# EAGLE design main-01 (EAGLE 7.6.0)
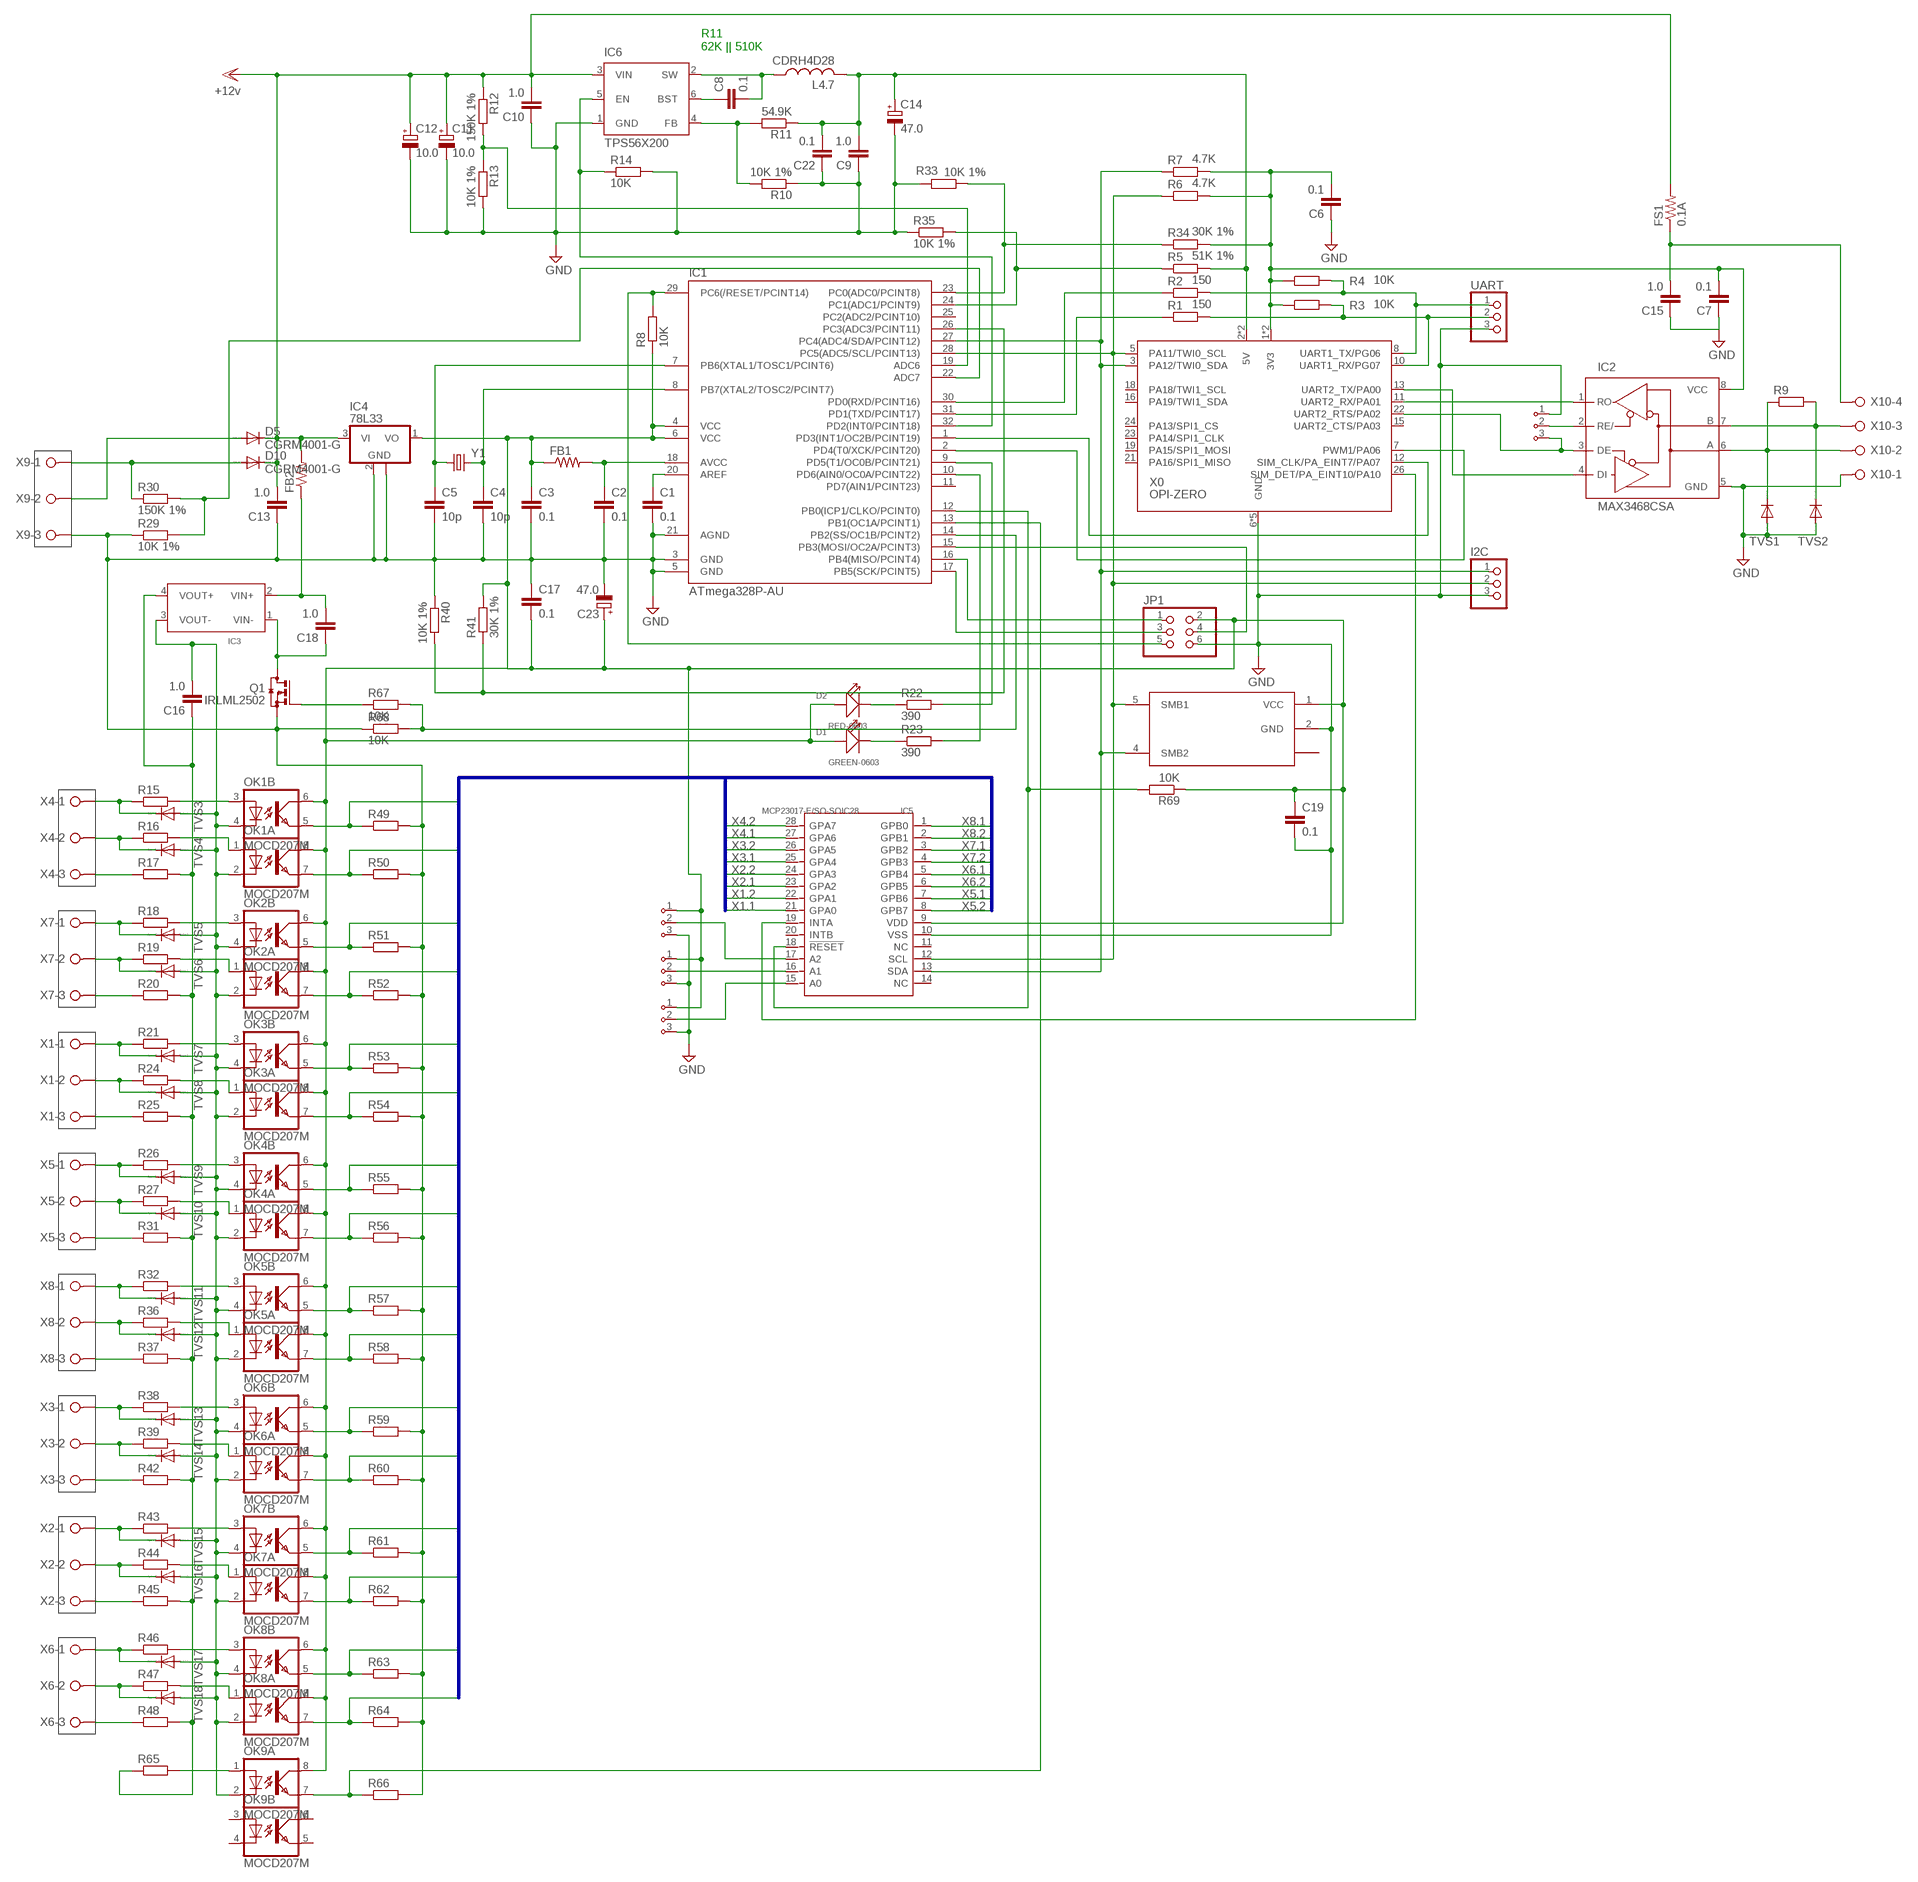
[diagram p0: schematic, sheet 1]

## Parts
4  ADDR3PIN0603  [0603-3PIN]
A0  ADDR3PIN0603  [0603-3PIN]
A1  ADDR3PIN0603  [0603-3PIN]
A2  ADDR3PIN0603  [0603-3PIN]
C1  0.1  C-EUC0603  [C0603]
C2  0.1  C-EUC0603  [C0603]
C3  0.1  C-EUC0603  [C0603]
C4  10p  C-EUC0603  [C0603]
C5  10p  C-EUC0603  [C0603]
C6  0.1  C-EUC0805  [C0805]
C7  0.1  C-EUC0805  [C0805]
C8  0.1  C-EUC0805  [C0805]
C9  1.0  C-EUC0805  [C0805]
C10  1.0  C-EUC1206  [C1206]
C11  10.0  CPOL-EUC/6032-28R  [C/6032-28R]
C12  10.0  CPOL-EUC/6032-28R  [C/6032-28R]
C13  1.0  C-EUC1206  [C1206]
C14  47.0  CPOL-EUB/3528-21R  [B/3528-21R]
C15  1.0  C-EUC1206  [C1206]
C16  1.0  C-EUC1206  [C1206]
C17  0.1  C-EUC0603  [C0603]
C18  1.0  C-EUC1206  [C1206]
C19  0.1  C-EUC0603  [C0603]
C22  0.1  C-EUC0805  [C0805]
C23  47.0  CPOL-EUB/3528-21R  [B/3528-21R]
D1  GREEN-0603  SMD-LED-CLEAR-GREEN(0603)  [LED-0603]
D2  RED-0603  SMD-LED-CLEAR-BLUE(0603)  [LED-0603]
D5  CGRM4001-G  [SOD-123_MINI-SMA]
D10  CGRM4001-G  [SOD-123_MINI-SMA]
FB1  R-US_R0805  [R0805]
FB2  R-US_R1206  [R1206]
FS1  0.1A  R-US_R1210  [R1210]
I2C  PINHD-1X3  [1X03]
IC1  ATmega328P-AU  MEGA48/88/168-AU  [TQFP32-08]
IC2  MAX3468CSA  [SO08]
IC3  DC-DC-CONV-4PIN-ISOLATINGMURATA-NME-05-12-SERIES  [DC-DC-MURATA-NME-05-12-SERIES]
IC4  78L33  78L05F  [SOT89]
IC5  MCP23017-E/SO-SOIC28  INTERFACE-MCP23017-E(SOIC28)  [SOIC28-1.27-17.9X7.5MM]
IC6  TPS56X200  [TSOT23-6_DDC]
IC7  LTC1694  [SOT23-5]
JP1  PINHD-2X3  [2X03]
L4.7  CDRH4D28  [CDRH4D28]
OK1  MOCD207M  [SOIC08-FAIRCHILD]
OK2  MOCD207M  [SOIC08-FAIRCHILD]
OK3  MOCD207M  [SOIC08-FAIRCHILD]
OK4  MOCD207M  [SOIC08-FAIRCHILD]
OK5  MOCD207M  [SOIC08-FAIRCHILD]
OK6  MOCD207M  [SOIC08-FAIRCHILD]
OK7  MOCD207M  [SOIC08-FAIRCHILD]
OK8  MOCD207M  [SOIC08-FAIRCHILD]
OK9  MOCD207M  [SOIC08-FAIRCHILD]
Q1  IRLML2502  [SOT23]
R1  150  R-EU_R0603  [R0603]
R2  150  R-EU_R0603  [R0603]
R3  10K  R-EU_R0603  [R0603]
R4  10K  R-EU_R0603  [R0603]
R5  51K 1%  R-EU_R0603  [R0603]
R6  4.7K  R-EU_R0603  [R0603]
R7  4.7K  R-EU_R0603  [R0603]
R8  10K  R-EU_R0603  [R0603]
R9  R-EU_R1206  [R1206]
R10  10K 1%  R-EU_R0603  [R0603]
R11  54.9K  R-EU_R0603  [R0603]
R12  150K 1%  R-EU_R0603  [R0603]
R13  10K 1%  R-EU_R0603  [R0603]
R14  10K  R-EU_R0603  [R0603]
R15  R-EU_R0603  [R0603]
R16  R-EU_R0603  [R0603]
R17  R-EU_R0603  [R0603]
R18  R-EU_R0603  [R0603]
R19  R-EU_R0603  [R0603]
R20  R-EU_R0603  [R0603]
R21  R-EU_R0603  [R0603]
R22  390  R-EU_R0603  [R0603]
R23  390  R-EU_R0603  [R0603]
R24  R-EU_R0603  [R0603]
R25  R-EU_R0603  [R0603]
R26  R-EU_R0603  [R0603]
R27  R-EU_R0603  [R0603]
R29  10K 1%  R-EU_R0603  [R0603]
R30  150K 1%  R-EU_R0603  [R0603]
R31  R-EU_R0603  [R0603]
R32  R-EU_R0603  [R0603]
R33  10K 1%  R-EU_R0603  [R0603]
R34  30K 1%  R-EU_R0603  [R0603]
R35  10K 1%  R-EU_R0603  [R0603]
R36  R-EU_R0603  [R0603]
R37  R-EU_R0603  [R0603]
R38  R-EU_R0603  [R0603]
R39  R-EU_R0603  [R0603]
R40  10K 1%  R-EU_R0603  [R0603]
R41  30K 1%  R-EU_R0603  [R0603]
R42  R-EU_R0603  [R0603]
R43  R-EU_R0603  [R0603]
R44  R-EU_R0603  [R0603]
R45  R-EU_R0603  [R0603]
R46  R-EU_R0603  [R0603]
R47  R-EU_R0603  [R0603]
R48  R-EU_R0603  [R0603]
R49  R-EU_R0603  [R0603]
R50  R-EU_R0603  [R0603]
R51  R-EU_R0603  [R0603]
R52  R-EU_R0603  [R0603]
R53  R-EU_R0603  [R0603]
R54  R-EU_R0603  [R0603]
R55  R-EU_R0603  [R0603]
R56  R-EU_R0603  [R0603]
R57  R-EU_R0603  [R0603]
R58  R-EU_R0603  [R0603]
R59  R-EU_R0603  [R0603]
R60  R-EU_R0603  [R0603]
R61  R-EU_R0603  [R0603]
R62  R-EU_R0603  [R0603]
R63  R-EU_R0603  [R0603]
R64  R-EU_R0603  [R0603]
R65  R-EU_R0603  [R0603]
R66  R-EU_R0603  [R0603]
R67  10K  R-EU_R0603  [R0603]
R68  10K  R-EU_R0603  [R0603]
R69  10K  R-EU_R0603  [R0603]
TVS1  DIODE-SOD323-W  [SOD323-W]
TVS2  DIODE-SOD323-W  [SOD323-W]
TVS3  DIODE-SOD323-W  [SOD323-W]
TVS4  DIODE-SOD323-W  [SOD323-W]
TVS5  DIODE-SOD323-W  [SOD323-W]
TVS6  DIODE-SOD323-W  [SOD323-W]
TVS7  DIODE-SOD323-W  [SOD323-W]
TVS8  DIODE-SOD323-W  [SOD323-W]
TVS9  DIODE-SOD323-W  [SOD323-W]
TVS10  DIODE-SOD323-W  [SOD323-W]
TVS11  DIODE-SOD323-W  [SOD323-W]
TVS12  DIODE-SOD323-W  [SOD323-W]
TVS13  DIODE-SOD323-W  [SOD323-W]
TVS14  DIODE-SOD323-W  [SOD323-W]
TVS15  DIODE-SOD323-W  [SOD323-W]
TVS16  DIODE-SOD323-W  [SOD323-W]
TVS17  DIODE-SOD323-W  [SOD323-W]
TVS18  DIODE-SOD323-W  [SOD323-W]
UART  PINHD-1X3  [1X03]
X0  OPI-ZERO  [OPI0]
X1  W237-03P  [W237-133]
X2  W237-03P  [W237-133]
X3  W237-03P  [W237-133]
X4  W237-03P  [W237-133]
X5  W237-03P  [W237-133]
X6  W237-03P  [W237-133]
X7  W237-03P  [W237-133]
X8  W237-03P  [W237-133]
X9  W237-03P  [W237-133]
X10  W237-04P  [W237-4P]
Y1  CRYSTALHC49US  [HC49US]

## Nets
12V [POWER]: C10.2 C11.+ C12.+ C13.2 D5.C D10.C FB2.2 FS1.2 IC4.3(VI) IC6.3(VIN) R12.1 ; supply symbol labelled +12v
GND [POWER]: 4.1 A0.3 A1.3 A2.3 C1.2 C2.2 C3.2 C4.2 C5.2 C6.1 C7.1 C9.1 C10.1 C11.- C12.- C13.1 C14.- C15.1 C17.1 C19.2 C22.1 C23.- I2C.3 IC1.3(GND) IC1.5(GND) IC1.21(AGND) IC2.5(GND) IC4.2(GND) IC4.2@1(GND) IC5.10(VSS) IC6.1(GND) IC7.2(GND) JP1.6 Q1.2(S) R10.1 R13.2 R14.2 R29.1 R33.2 R35.1 R40.1 R49.2 R50.2 R51.2 R52.2 R53.2 R54.2 R55.2 R56.2 R57.2 R58.2 R59.2 R60.2 R61.2 R62.2 R63.2 R64.2 R66.2 R68.1 TVS1.A TVS2.A UART.3 X0.6(GND) X0.9(GND) X0.14(GND) X0.20(GND) X0.25(GND) X9.3 X10.1
N$1: 4.3 IC2.3(DE) X0.22(UART2_RTS/PA02)
N$2: IC2.1(RO) X0.11(UART2_RX/PA01)
N$3 [POWER]: C8.2 IC6.2(SW) L4.7.P$1
N$4: C4.1 IC1.8(PB7(XTAL2/TOSC2/PCINT7)) Y1.2
N$5: IC1.30(PD0(RXD/PCINT16)) R2.1
N$6: IC1.31(PD1(TXD/PCINT17)) R1.1
N$7: R1.2 R3.2 UART.2 X0.10(UART1_RX/PG07)
N$8: R2.2 R4.2 UART.1 X0.8(UART1_TX/PG06)
N$9: IC2.4(DI) X0.13(UART2_TX/PA00)
N$10: C5.1 IC1.7(PB6(XTAL1/TOSC1/PCINT6)) Y1.1
N$11: IC1.24(PC1(ADC1/PCINT9)) R5.1 R35.2
N$12 [POWER]: D5.A X9.2
N$13: IC1.29(PC6(/RESET/PCINT14)) JP1.5 R8.2
N$14: OK1.3(B:A) R15.2
N$15: C1.1 IC1.20(AREF)
N$16: C2.1 FB1.2 IC1.18(AVCC)
N$17: C8.1 IC6.6(BST)
N$18: IC1.15(PB3(MOSI/OC2A/PCINT3)) JP1.4
N$19: IC1.17(PB5(SCK/PCINT5)) JP1.3
N$20: IC1.16(PB4(MISO/PCINT4)) JP1.1
N$21: IC2.6(A) R9.1 TVS1.C X10.2
N$22: IC6.4(FB) R10.2 R11.2
N$23: IC2.7(B) R9.2 TVS2.C X10.3
N$24: C15.2 FS1.1 X10.4
N$25: IC1.19(ADC6) R12.2 R13.1
N$26: R15.1 TVS3.C X4.1
N$27: IC1.32(PD2(INT0/PCINT18)) IC6.5(EN) R14.1
N$28: R16.1 TVS4.C X4.2
N$29: IC1.1(PD3(INT1/OC2B/PCINT19)) X0.12(SIM_CLK/PA_EINT7/PA07)
N$30: R17.1 X4.3
N$31 [POWER]: D10.A R30.1 X9.1
N$32: R18.1 TVS5.C X7.1
N$33: R19.1 TVS6.C X7.2
N$34: R20.1 X7.3
N$35: OK2.3(B:A) R18.2
N$36: R21.1 TVS7.C X1.1
N$37: IC1.10(PD6(AIN0/OC0A/PCINT22)) R23.2
N$38: IC1.9(PD5(T1/OC0B/PCINT21)) R22.2
N$39: OK3.3(B:A) R21.2
N$40: R24.1 TVS8.C X1.2
N$41: R25.1 X1.3
N$42: R26.1 TVS9.C X5.1
N$43: R27.1 TVS10.C X5.2
N$44: R31.1 X5.3
N$45: R32.1 TVS11.C X8.1
N$46: R36.1 TVS12.C X8.2
N$47: R37.1 X8.3
N$48: R38.1 TVS13.C X3.1
N$49: R39.1 TVS14.C X3.2
N$50: R42.1 X3.3
N$51: R43.1 TVS15.C X2.1
N$52: R44.1 TVS16.C X2.2
N$53: R45.1 X2.3
N$54: R46.1 TVS17.C X6.1
N$55: R47.1 TVS18.C X6.2
N$56: R48.1 X6.3
N$57: OK4.3(B:A) R26.2
N$58: OK5.3(B:A) R32.2
N$59: OK6.3(B:A) R38.2
N$60: OK7.3(B:A) R43.2
N$61: IC1.22(ADC7) R29.2 R30.2
N$62: OK8.3(B:A) R46.2
N$63: C16.1 IC3.4(VOUT+) R17.2 R20.2 R25.2 R31.2 R37.2 R42.2 R45.2 R48.2 R65.1
N$64: IC1.23(PC0(ADC0/PCINT8)) R33.1 R34.1
N$65: OK1.1(A:A) R16.2
N$66: OK2.1(A:A) R19.2
N$67: OK3.1(A:A) R24.2
N$68: IC1.26(PC3(ADC3/PCINT11)) R40.2 R41.1
N$69: OK4.1(A:A) R27.2
N$70: OK5.1(A:A) R36.2
N$71: OK6.1(A:A) R39.2
N$72: OK7.1(A:A) R44.2
N$73: OK8.1(A:A) R47.2
N$74: C16.2 IC3.3(VOUT-) OK1.2(A:C) OK1.4(B:C) OK2.2(A:C) OK2.4(B:C) OK3.2(A:C) OK3.4(B:C) OK4.2(A:C) OK4.4(B:C) OK5.2(A:C) OK5.4(B:C) OK6.2(A:C) OK6.4(B:C) OK7.2(A:C) OK7.4(B:C) OK8.2(A:C) OK8.4(B:C) OK9.2(A:C) TVS3.A TVS4.A TVS5.A TVS6.A TVS7.A TVS8.A TVS9.A TVS10.A TVS11.A TVS12.A TVS13.A TVS14.A TVS15.A TVS16.A TVS17.A TVS18.A
N$75: D2.- R22.1
N$76: 4.2 IC2.2(RE/)
N$77: IC1.2(PD4(T0/XCK/PCINT20)) X0.7(PWM1/PA06)
N$92: IC5.19(INTA) X0.26(SIM_DET/PA_EINT10/PA10)
N$93: OK9.1(A:A) R65.2
N$94: IC1.13(PB1(OC1A/PCINT1)) OK9.7(A:EMIT) R66.1
N$95: Q1.1(G) R67.1
N$96: IC1.14(PB2(SS/OC1B/PCINT2)) R67.2 R68.2
N$98: C18.1 IC3.1(VIN-) Q1.3(D)
N$99 [POWER]: C18.2 FB2.1 IC3.2(VIN+)
N$115: IC1.12(PB0(ICP1/CLKO/PCINT0)) IC5.18(!RESET) R69.2
N$116: A0.2 IC5.15(A0)
N$117: A1.2 IC5.16(A1)
N$118: A2.2 IC5.17(A2)
N$119: D1.- R23.1
SCL: I2C.2 IC1.28(PC5(ADC5/SCL/PCINT13)) IC5.12(SCL) IC7.5(SMB1) R6.1 X0.5(PA11/TWI0_SCL)
SDA: I2C.1 IC1.27(PC4(ADC4/SDA/PCINT12)) IC5.13(SDA) IC7.4(SMB2) R7.1 X0.3(PA12/TWI0_SDA)
VCC [POWER]: A0.1 A1.1 A2.1 C3.1 C17.2 C19.1 C23.+ D1.+ D2.+ FB1.1 IC1.4(VCC) IC1.6(VCC) IC4.1(VO) IC5.9(VDD) IC7.1(VCC) JP1.2 OK1.6(B:COL) OK1.8(A:COL) OK2.6(B:COL) OK2.8(A:COL) OK3.6(B:COL) OK3.8(A:COL) OK4.6(B:COL) OK4.8(A:COL) OK5.6(B:COL) OK5.8(A:COL) OK6.6(B:COL) OK6.8(A:COL) OK7.6(B:COL) OK7.8(A:COL) OK8.6(B:COL) OK8.8(A:COL) OK9.8(A:COL) R8.1 R41.2 R69.1
X1.1: IC5.21(GPA0) OK3.5(B:EMIT) R53.1
X1.2: IC5.22(GPA1) OK3.7(A:EMIT) R54.1
X2.1: IC5.23(GPA2) OK7.5(B:EMIT) R61.1
X2.2: IC5.24(GPA3) OK7.7(A:EMIT) R62.1
X3.1: IC5.25(GPA4) OK6.5(B:EMIT) R59.1
X3.2: IC5.26(GPA5) OK6.7(A:EMIT) R60.1
X4.1: IC5.27(GPA6) OK1.5(B:EMIT) R49.1
X4.2: IC5.28(GPA7) OK1.7(A:EMIT) R50.1
X5.1: IC5.7(GPB6) OK4.5(B:EMIT) R55.1
X5.2: IC5.8(GPB7) OK4.7(A:EMIT) R56.1
X6.1: IC5.5(GPB4) OK8.5(B:EMIT) R63.1
X6.2: IC5.6(GPB5) OK8.7(A:EMIT) R64.1
X7.1: IC5.3(GPB2) OK2.5(B:EMIT) R51.1
X7.2: IC5.4(GPB3) OK2.7(A:EMIT) R52.1
X8.1: IC5.1(GPB0) OK5.5(B:EMIT) R57.1
X8.2: IC5.2(GPB1) OK5.7(A:EMIT) R58.1
Z3V3 [POWER]: C6.2 C7.2 IC2.8(VCC) R3.1 R4.1 R6.2 R7.2 R34.2 X0.1(3V3) X0.17(3V3)
Z5V [POWER]: C9.2 C14.+ C22.2 L4.7.P$2 R5.2 R11.1 X0.2(5V) X0.4(5V)
Unconnected: IC1.11(PD7(AIN1/PCINT23)) IC1.25(PC2(ADC2/PCINT10)) IC5.11(NC) IC5.14(NC) IC5.20(INTB) IC7.3(NC) OK9.3(B:A) OK9.4(B:C) OK9.5(B:EMIT) OK9.6(B:COL) X0.15(UART2_CTS/PA03) X0.16(PA19/TWI1_SDA) X0.18(PA18/TWI1_SCL) X0.19(PA15/SPI1_MOSI) X0.21(PA16/SPI1_MISO) X0.23(PA14/SPI1_CLK) X0.24(PA13/SPI1_CS)

## Buses
B$1

## Notes on the sheet
- R11
  62K || 510K

## Library data of the parts
4 A0 A1 A2 = components:ADDR3PIN
C1-C10 C13 C15-C19 C22 = rcl:C-EU: CAPACITOR, European symbol
C11 C12 C14 C23 = rcl:CPOL-EU: POLARIZED CAPACITOR, European symbol
D1 = Seeed-OPL-Diode:SMD-LED-CLEAR-GREEN(0603): 304090043; MPN: 19-217-G7C-AN1P2-3T
D2 = Seeed-OPL-Diode:SMD-LED-CLEAR-BLUE(0603): 304090045; MPN: 19-217-BHC-ZL1M2RY-3T; VALUE: BLUE-0603
D5 D10 = diode:CGRM400*-G: Molded plasitc,JEDEC SOD-123/Mini SMA Source: Comchip CGRM4001-G.pdf
FB1 FB2 FS1 = rcl:R-US_: RESISTOR, American symbol
I2C UART = pinhead:PINHD-1X3: PIN HEADER
IC1 = avr-7:MEGA48/88/168
IC2 = maxim:MAX34*: +5V, Fail-Safe, 40Mbps, Profibus RS-485/RS-422 Transceivers Source: MAX3465-MAX3469.pdf; MPN: MAX3468CSA+; OC_FARNELL: unknown; OC_NEWARK: 76K6721
IC3 = SteveMarple:DC-DC-CONV-4PIN-ISOLATING
IC4 = linear:78L*: POSITOIV-VOLTAGE REGULATORS Output up to 100 mA Source: Datasheet <http://focus.ti.com/lit/ds/symlink/ua78l05.pdf>
IC5 = Seeed-OPL-ic:INTERFACE-MCP23017-E(SOIC28): 310070050; MPN: MCP23017-E/SO
IC6 = custom:TPS56X200
IC7 = components:LTC1694: Dual SMBus active pull-up
JP1 = pinhead:PINHD-2X3: PIN HEADER
L4.7 = custom:CDRH4D28
OK1-OK9 = optocoupler:MOCD20*M: MOCD207M, MOCD208M Dual Channel Phototransistor Small Outline Surface Mount Optocouplers Source: Data sheet <http://www.fairchildsemi.com/ds/MO%2FMOCD207-M.pdf>; MF: FAIRCHILD SEMICONDUCTOR; MPN: MOCD207-M; OC_FARNELL: 1623297; OC_NEWARK: 67K0803
Q1 = components:IRLML2502: N-CHANNEL MOS FET
R1-R27 R29-R69 = rcl:R-EU_: RESISTOR, European symbol
TVS1-TVS18 = diode:DIODE-: DIODE
X0 = OrangePi0:OPI-ZERO: Orange Pi Zero Footprint. Only 2x13 pin header. -- UNTESTED!
X1-X9 = con-wago-508:W237-03P: WAGO SREW CLAMP; OC_FARNELL: unknown; OC_NEWARK: unknown
X10 = con-wago-508:W237-04P: WAGO SREW CLAMP; OC_FARNELL: unknown; OC_NEWARK: unknown
Y1 = SteveMarple:CRYSTAL: Crystals Various standard crystals. Proven footprints. Spark Fun Electronics SKU : COM-00534

## Net classes
0 default: width 0.254 mm, clearance 0.254 mm
1 POWER: width 0.508 mm, clearance 0.254 mm
2 HV: width 1.27 mm, clearance 1.27 mm

## Board
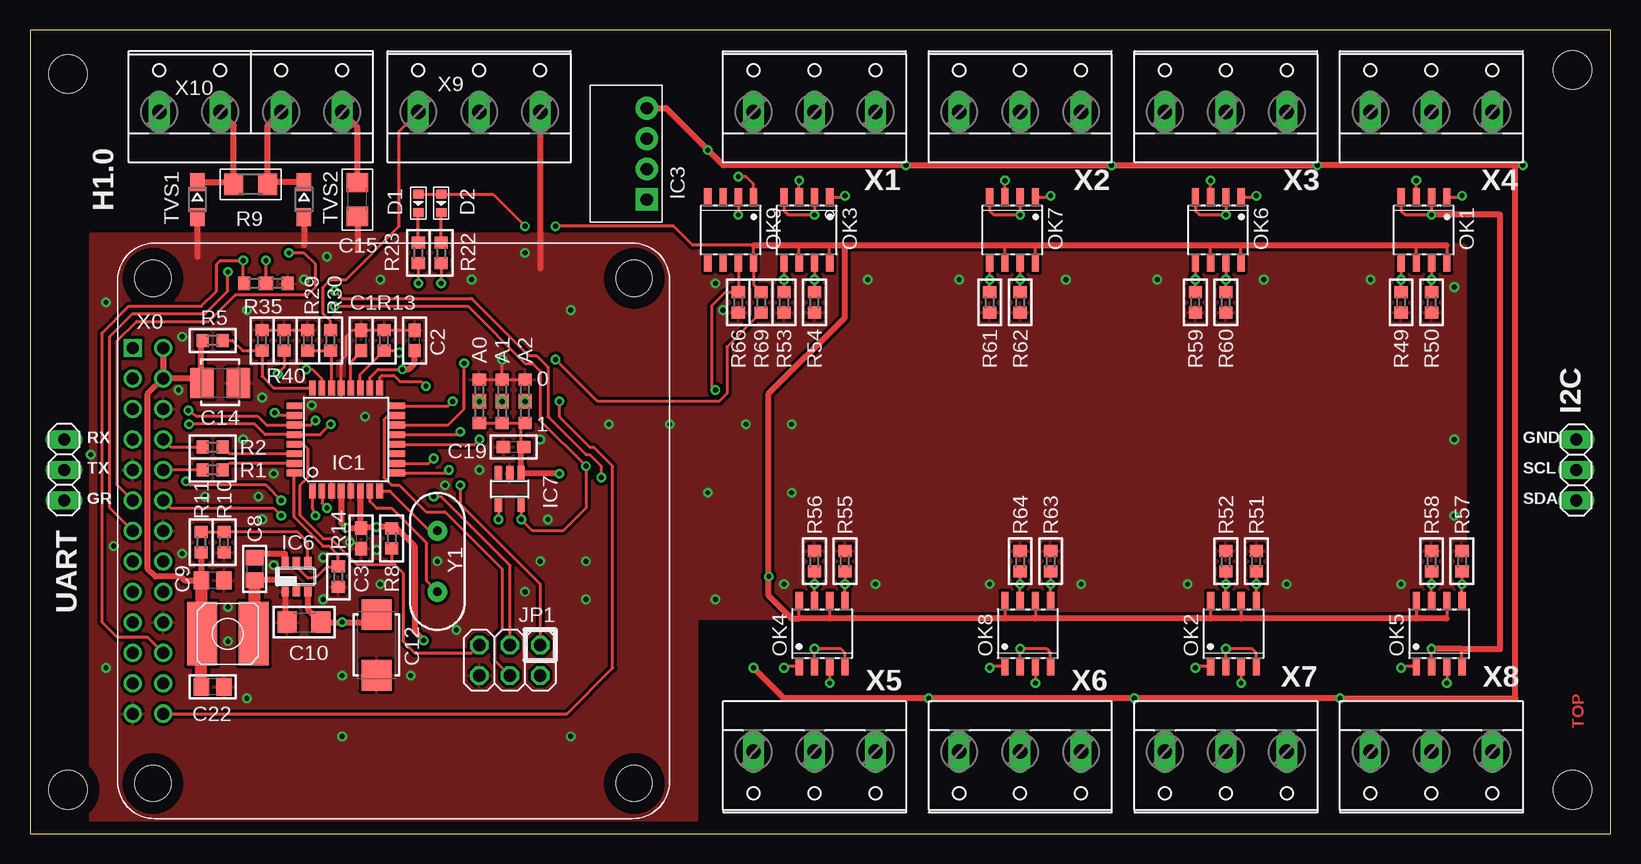
[diagram p1: board, top side]
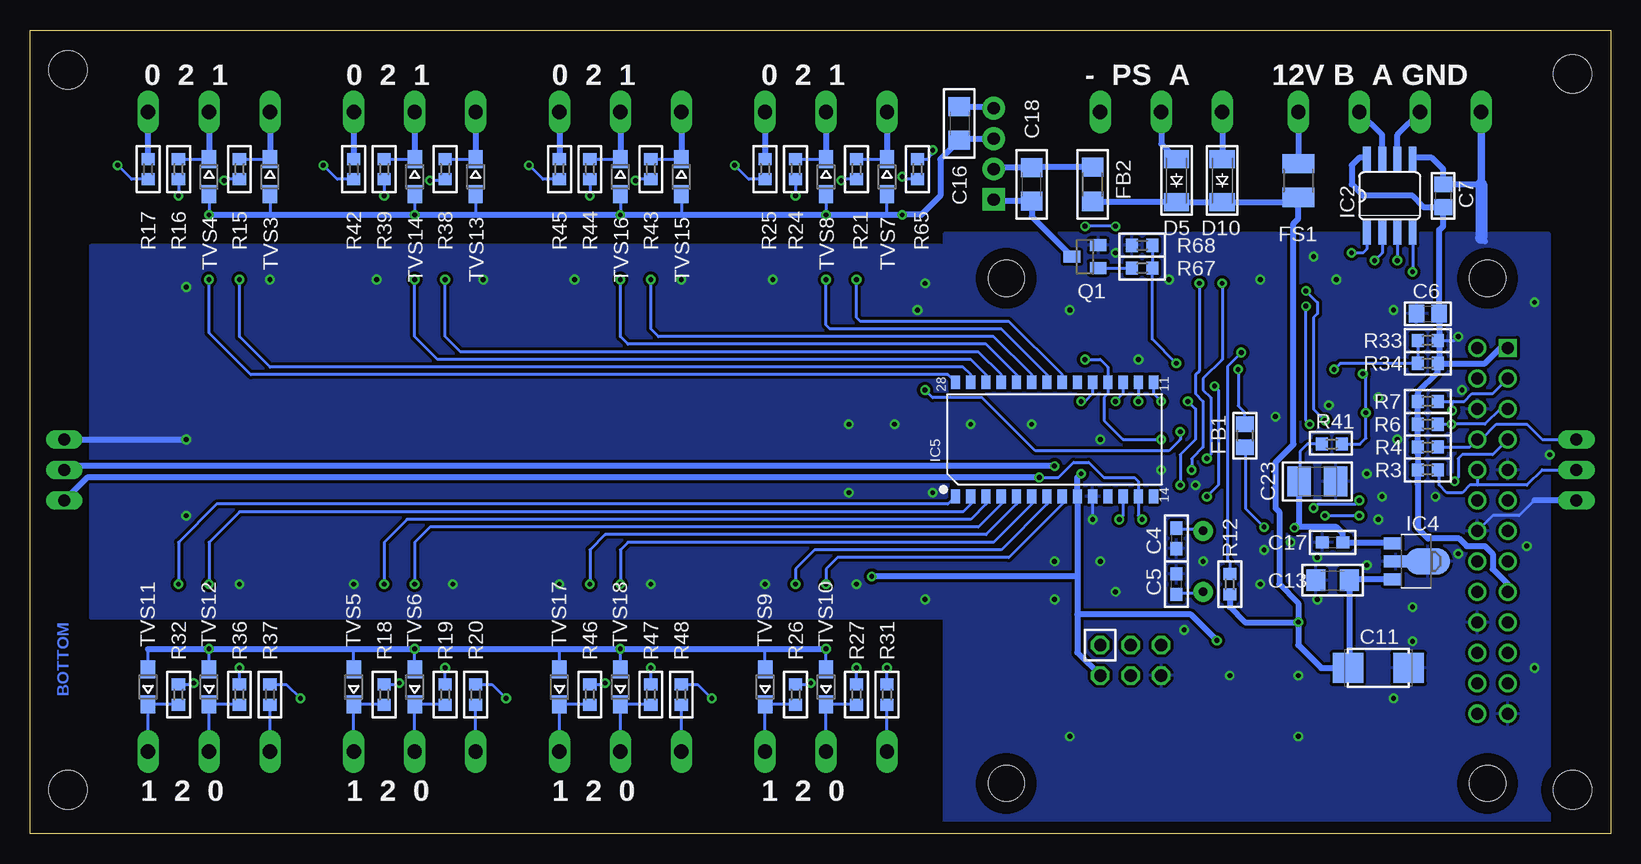
[diagram p2: board, bottom side, seen from below]

Size 131.75 x 67.04 mm. Coordinates in mm from the lower left corner, seen from the top.
Outline: 131.75,0 131.75,67.04 0,67.04 0,0 131.75,0
Copper layers (1*16): Top 0.035mm / dielectric 1.5mm / Bottom 0.035mm
Design rules "default *": minimum track width 10mil, minimum drill 16mil, track to track 8mil, track to pad 8mil, pad to pad 10mil, via to via 10mil, smd to smd 10mil, copper to edge 40mil, drill to drill 10mil, minimum pad ring 10mil, minimum via ring 8mil, stop-mask expansion 4mil, vias tented up to drill 20mil, thermal gap 10mil
Holes 3.2 mm at 3.16,63.37 128.58,63.69 128.58,3.68 3.16,3.68

### Footprints (pad centres in the part's own frame; a part is rotated, then mirrored left to right if it is on the bottom)
0603-3PIN = smd 1 x 1.1: 1 -0.85,1.27; 3 2.755,1.27 | smd 1.227 x 1.1: 2 0.954,1.27
C0603 = smd 1.1 x 1: 1 -0.85,0; 2 0.85,0
C0805 = smd 1.3 x 1.5: 1 -0.95,0; 2 0.95,0
C1206 = smd 1.6 x 1.8: 1 -1.4,0; 2 1.4,0
C/6032-28R = smd 2.55 x 2.5: + 2.525,0; - -2.525,0
B/3528-21R = smd 1.95 x 2.5: + 1.525,0; - -1.525,0
LED-0603 = smd 0.762 x 0.889: + -0.762,0; - 0.762,0
SOD-123_MINI-SMA = smd 1.5 x 2.1: A 1.8,0; C -1.8,0
R0805 = smd 1.3 x 1.5: 1 -0.95,0; 2 0.95,0
R1206 = smd 1.6 x 1.803: 1 -1.422,0; 2 1.422,0
R1210 = smd 1.6 x 2.7: 1 -1.4,0; 2 1.4,0
1X03 = drill 1.016 long: 1 -2.54,0; 2 0,0; 3 2.54,0
TQFP32-08 = smd 1.27 x 0.559: 1 -4.293,2.8; 2 -4.293,2; 3 -4.293,1.2; 4 -4.293,0.4; 5 -4.293,-0.4; 6 -4.293,-1.2; 7 -4.293,-2; 8 -4.293,-2.8; 17 4.293,-2.8; 18 4.293,-2; 19 4.293,-1.2; 20 4.293,-0.4; 21 4.293,0.4; 22 4.293,1.2; 23 4.293,2; 24 4.293,2.8 | smd 0.559 x 1.27: 9 -2.8,-4.293; 10 -2,-4.293; 11 -1.2,-4.293; 12 -0.4,-4.293; 13 0.4,-4.293; 14 1.2,-4.293; 15 2,-4.293; 16 2.8,-4.293; 25 2.8,4.293; 26 2,4.293; 27 1.2,4.293; 28 0.4,4.293; 29 -0.4,4.293; 30 -1.2,4.293; 31 -2,4.293; 32 -2.8,4.293
SO08 = smd 0.66 x 2.032: 1 -1.905,-3.073; 2 -0.635,-3.073; 3 0.635,-3.073; 4 1.905,-3.073; 5 1.905,3.073; 6 0.635,3.073; 7 -0.635,3.073; 8 -1.905,3.073
DC-DC-MURATA-NME-05-12-SERIES = drill 1.016 pad 1.88 square: 1 -3.81,0 | drill 1.016 pad 1.88: 2 -1.27,0; 3 1.27,0; 4 3.81,0
SOT89 = smd 1 x 1.5: 1 -1.499,-1.981; 3 1.499,-1.981 | smd 1 x 2: 2 0,-1.727 | smd 2.2 x 3.7: 2@1 0,0.94
SOIC28-1.27-17.9X7.5MM = smd 0.762 x 1.143: 1 -8.255,-4.75; 2 -6.985,-4.75; 3 -5.715,-4.75; 4 -4.445,-4.75; 5 -3.175,-4.75; 6 -1.905,-4.75; 7 -0.635,-4.75; 8 0.635,-4.75; 9 1.905,-4.75; 10 3.175,-4.75; 11 4.445,-4.75; 12 5.715,-4.75; 13 6.985,-4.75; 14 8.255,-4.75; 15 8.255,4.775; 16 6.985,4.775; 17 5.715,4.775; 18 4.445,4.775; 19 3.175,4.775; 20 1.905,4.775; 21 0.635,4.775; 22 -0.635,4.775; 23 -1.905,4.775; 24 -3.175,4.775; 25 -4.445,4.775; 26 -5.715,4.775; 27 -6.985,4.775; 28 -8.255,4.775
TSOT23-6_DDC = smd 0.6 x 0.8: 1 -0.95,-1.25; 2 0,-1.25; 3 0.95,-1.25; 4 0.95,1.25; 5 0,1.25; 6 -0.95,1.25
SOT23-5 = smd 0.6 x 1.2: 1 -0.95,-1.306; 2 0,-1.306; 3 0.95,-1.306; 4 0.95,1.306; 5 -0.95,1.306
2X03 = drill 1.016 octagon: 1 -2.54,-1.27; 2 -2.54,1.27; 3 0,-1.27; 4 0,1.27; 5 2.54,-1.27; 6 2.54,1.27
CDRH4D28 = smd 2.5 x 5.3: P$1 -2.159,0; P$2 2.159,0
SOIC08-FAIRCHILD = smd 0.61 x 1.52: 1 -1.905,-2.723; 2 -0.635,-2.723; 3 0.635,-2.723; 4 1.905,-2.723; 5 1.905,2.723; 6 0.635,2.723; 7 -0.635,2.723; 8 -1.905,2.723
SOT23 = smd 1 x 1.4: 1 -0.95,-1.1; 2 0.95,-1.1; 3 0,1.1
R0603 = smd 1 x 1.1: 1 -0.85,0; 2 0.85,0
SOD323-W = smd 1.5 x 1.2: A 1.45,0; C -1.45,0
OPI0 = drill 1 square: 1 0,0 | drill 1: 2 0,2.54; 3 2.54,0; 4 2.54,2.54; 5 5.08,0; 6 5.08,2.54; 7 7.62,0; 8 7.62,2.54; 9 10.16,0; 10 10.16,2.54; 11 12.7,0; 12 12.7,2.54; 13 15.24,0; 14 15.24,2.54; 15 17.78,0; 16 17.78,2.54; 17 20.32,0; 18 20.32,2.54; 19 22.86,0; 20 22.86,2.54; 21 25.4,0; 22 25.4,2.54; 23 27.94,0; 24 27.94,2.54; 25 30.48,0; 26 30.48,2.54 | hole 3: -5.815,1.694; 36.295,1.694; 36.295,41.805; -5.815,41.805
W237-133 = drill 1.194 long: 1 -5.08,-0.635; 2 0,-0.635; 3 5.08,-0.635
W237-4P = drill 1.194 long: 1 -7.62,-0.635; 2 -2.54,-0.635; 3 2.54,-0.635; 4 7.62,-0.635
HC49US = drill 0.7 pad 1.651: 1 -2.54,0; 2 2.54,0

### Placement (x,y rotation side)
4  20.62,47.18 180 top
A0  38.72,35.12 90 top
A1  40.63,35.12 90 top
A2  42.53,35.12 90 top
C1  27.61,41.15 90 top
C2  32.05,41.15 90 top
C3  27.61,24.64 270 top
C4  36.18,24.64 270 bottom
C5  36.18,20.83 90 bottom
C6  15.23,43.37 0 bottom
C7  13.96,53.21 270 bottom
C8  18.72,22.1 270 top
C9  15.23,21.15 180 top
C10  22.85,17.65 0 top
C11  19.35,13.84 180 bottom
C12  28.88,15.75 90 top
C13  23.16,21.15 0 bottom
C14  15.86,37.6 180 top
C15  27.29,52.9 90 top
C16  54.28,59.25 270 bottom
C17  23.16,24.32 0 bottom
C18  48.25,54.17 90 bottom
C19  40.31,32.26 180 top
C22  15.23,12.26 180 top
C23  24.44,29.4 180 bottom
D1  32.37,52.58 270 top
D2  34.28,52.58 270 top
D5  36.18,54.48 90 bottom
D10  32.37,54.48 90 bottom
FB1  30.47,33.21 90 bottom
FB2  43.17,54.17 270 bottom
FS1  26.02,54.48 270 bottom
I2C  128.89,30.35 90 top
IC1  26.34,32.89 90 top
IC2  18.4,53.21 0 bottom
IC3  51.42,56.71 90 top
IC4  16.18,22.73 270 bottom
IC5  46.34,32.89 0 bottom
IC6  22.21,21.46 0 top
IC7  39.99,28.77 180 top
JP1  39.99,14.48 180 top
L4.7  16.5,16.7 180 top
OK1  116.19,50.36 180 top
OK2  100.32,16.7 0 top
OK3  64.76,50.36 180 top
OK4  66.03,16.7 0 top
OK5  117.46,16.7 0 top
OK6  99.05,50.36 180 top
OK7  81.9,50.36 180 top
OK8  83.17,16.7 0 top
OK9  58.41,50.36 180 top
Q1  43.8,48.13 90 bottom
R1  15.23,30.35 180 top
R2  15.23,32.26 180 top
R3  15.23,30.35 0 bottom
R4  15.23,32.26 0 bottom
R5  15.23,41.15 180 top
R6  15.23,34.16 180 bottom
R7  15.23,36.07 180 bottom
R8  30.15,24.64 270 top
R9  18.4,54.17 0 top
R10  16.18,24.32 90 top
R11  14.28,24.32 90 top
R12  31.74,20.83 90 bottom
R13  29.52,41.15 90 top
R14  25.7,21.46 270 top
R15  114.29,55.44 270 bottom
R16  119.37,55.44 270 bottom
R17  121.91,55.44 270 bottom
R18  102.22,11.62 90 bottom
R19  97.14,11.62 90 bottom
R20  94.6,11.62 90 bottom
R21  62.85,55.44 270 bottom
R22  34.28,48.45 270 top
R23  32.37,48.45 270 top
R24  67.93,55.44 270 bottom
R25  70.47,55.44 270 bottom
R26  67.93,11.62 90 bottom
R27  62.85,11.62 90 bottom
R29  23.16,41.15 270 top
R30  25.06,41.15 270 top
R31  60.31,11.62 90 bottom
R32  119.37,11.62 90 bottom
R33  15.23,41.15 0 bottom
R34  15.23,39.24 0 bottom
R35  19.35,41.15 270 top
R36  114.29,11.62 90 bottom
R37  111.75,11.62 90 bottom
R38  97.14,55.44 270 bottom
R39  102.22,55.44 270 bottom
R40  21.19,41.15 270 top
R41  23.23,32.51 180 bottom
R42  104.76,55.44 270 bottom
R43  80,55.44 270 bottom
R44  85.08,55.44 270 bottom
R45  87.62,55.44 270 bottom
R46  85.08,11.62 90 bottom
R47  80,11.62 90 bottom
R48  77.46,11.62 90 bottom
R49  114.29,44.32 270 top
R50  116.83,44.32 270 top
R51  102.22,22.73 90 top
R52  99.68,22.73 90 top
R53  62.85,44.32 270 top
R54  65.39,44.32 270 top
R55  67.93,22.73 90 top
R56  65.39,22.73 90 top
R57  119.37,22.73 90 top
R58  116.83,22.73 90 top
R59  97.14,44.32 270 top
R60  99.68,44.32 270 top
R61  80,44.32 270 top
R62  82.54,44.32 270 top
R63  85.08,22.73 90 top
R64  82.54,22.73 90 top
R65  57.77,55.44 270 bottom
R66  59.04,44.32 270 top
R67  39.04,47.18 0 bottom
R68  39.04,49.09 0 bottom
R69  60.95,44.32 270 top
TVS1  13.96,52.9 270 top
TVS2  22.85,52.9 270 top
TVS3  111.75,54.8 270 bottom
TVS4  116.83,54.8 270 bottom
TVS5  104.76,12.26 90 bottom
TVS6  99.68,12.26 90 bottom
TVS7  60.31,54.8 270 bottom
TVS8  65.39,54.8 270 bottom
TVS9  70.47,12.26 90 bottom
TVS10  65.39,12.26 90 bottom
TVS11  121.91,12.26 90 bottom
TVS12  116.83,12.26 90 bottom
TVS13  94.6,54.8 270 bottom
TVS14  99.68,54.8 270 bottom
TVS15  77.46,54.8 270 bottom
TVS16  82.54,54.8 270 bottom
TVS17  87.62,12.26 90 bottom
TVS18  82.54,12.26 90 bottom
UART  2.85,30.35 270 top
X0  8.56,40.51 270 top
X1  65.39,60.83 0 top
X2  82.54,60.83 0 top
X3  99.68,60.83 0 top
X4  116.83,60.83 0 top
X5  65.39,6.22 180 top
X6  82.54,6.22 180 top
X7  99.68,6.22 180 top
X8  116.83,6.22 180 top
X9  37.45,60.83 0 top
X10  18.4,60.83 0 top
Y1  33.96,22.73 90 top

### Tracks (layer width: path | path; a pad name or v marks a point on that pad's centre or on a via)
12V  (via drill 0.4)
  Top 0.508: 23.17,20.19 23.16,20.19 23.23,20.19 IC6.3 23.16,18.74 C10.2 v26.02,17.65 28.55,17.65
  Top 1.016: C12.+ 28.55,17.65
  Bottom 0.508: FB2.2 36.24,52.74 D5.C D10.C 26.42,52.68 | IC4.3 21.68,21.23 C13.2 21.76,13.96 C11.+ 24.12,13.84 26.02,15.75 v26.02,17.65 | R12.1 31.74,18.92 30.47,17.65 v26.02,17.65 | v26.02,17.65 26.02,19.24 27.61,20.83 27.61,26.86 27.93,27.18 27.93,30.99 26.42,32.49 26.42,50.91 26.02,51.31 26.02,52.28 26.42,52.68 | 26.42,52.68 FS1.2
GND  (via drill 0.4)
  Top 0.254: A0.3 A1.3 | A1.3 A2.3 | A1.3 v39.36,39.56 | IC1.21 25.94,39.48 26.34,39.88 26.34,41.47 26.87,42 C1.2 R13.2 C2.2 | R35.1 R40.1 R29.1
  Top 0.508: IC6.1 21.26,17.84 C10.1 | TVS1.A 13.96,48.13 | 22.9,51.5 TVS2.A 22.85,49.09 | X9.3 42.53,47.18 | C15.1 27.29,48.77
  Bottom 0.254: IC5.10 v43.17,26.23 | 6.34,27.81 7.61,26.54 9.83,26.54 X0.14 | R33.2 13.01,41.15 v12.69,41.47
  Bottom 0.508: I2C.3 v118.73,32.89 | UART.3 6.34,27.81 | IC2.5 16.4,56.39 14.91,56.39 13.96,55.43 C7.1 10.79,54.16 10.78,54.16 | 10.78,49.72 10.46,49.4
  Bottom 0.61: X10.1 10.78,54.16
  Bottom 1.016: 10.78,54.16 10.78,49.72
  other vias: 118.73,26.54 53.33,34.16 57.14,45.91 48.25,34.16 46.34,22.73 35.55,17.02 19.35,36.39 17.77,32.89 5.07,31.62 24.75,48.13 6.34,44.32 57.77,43.69 27.93,34.8 26.02,13.21 31.74,13.21 29.2,20.83 42.53,22.73 6.34,13.84 26.02,8.13 45.07,8.13 57.14,19.56 63.49,34.16 69.84,46.23 77.46,46.23 86.35,46.23 93.97,46.23 102.86,46.23 111.75,46.23 118.73,45.59 70.47,20.83 80,20.83 87.62,20.83 96.51,20.83 104.76,20.83 114.29,20.83 62.85,20.83 14.59,28.13 46.34,19.56 41.26,20.19 33.96,22.73 37.45,30.35 16.5,18.92 16.5,16.07 18.09,11.3 24.44,19.56 24.44,23.05 12.37,37.02 23.48,35.75 34.59,29.08 20.31,22.42 6.97,24 12.69,23.37 42.53,32.89 45.07,43.69 29.2,46.23 22.85,46.23 28.88,23.69 18.09,43.69 56.5,28.45 63.49,28.45 59.68,34.16 36.82,46.23 41.26,48.45 20.31,30.04 19.04,28.13 19.35,26.23 26.66,24.32
  pour Bottom: 5.07,0.83 5.07,50.04 55.55,50.04 55.55,0.83
  pour Top: 5.07,0.83 5.07,50.04 55.55,50.04 55.55,0.83
  pour Bottom: 55.23,49.09 55.23,17.97 126.67,17.97 126.67,49.09
  pour Top: 55.23,49.09 55.23,17.97 119.69,17.97 119.69,49.09
N$1  (via drill 0.4)
  Top 0.254: X0.22 9.83,16.38 7.29,16.38 6.02,17.65 6.02,41.78 8.24,44.01 14.28,44.01 15.54,45.28 15.54,47.5 15.86,47.82 v17.77,47.82 17.77,46.01 4.3
  Bottom 0.254: IC2.3 v17.77,47.82
N$2  (via drill 0.4)
  Top 0.254: X0.11 7.29,29.08 7.29,41.15 8.88,42.73 14.91,42.73 17.13,44.96 23.17,44.96 23.8,45.59 23.8,47.5 22.85,48.45 v21.58,48.45
  Bottom 0.254: IC2.1 20.31,48.77 20.63,48.45 v21.58,48.45
N$3
  Top 0.508: IC6.2 22.21,20.7 21.7,21.21 18.72,21.21 C8.2
  Top 1.016: L4.7.P$1 18.72,16.95 C8.2
N$4
  Top 0.254: Y1.2 33.33,25.27 30.02,28.58 29.26,28.58 IC1.8
  Bottom 0.254: Y1.2 34.09,25.4 36.12,25.4 C4.1
N$5
  Top 0.254: IC1.30 16.64,31.69 R2.1
N$6
  Top 0.254: IC1.31 16.62,30.89 R1.1
N$7
  Top 0.254: 14.4,30.35 R3.2 X0.10
  Bottom 0.254: 11.1,29.08 6.97,29.08 5.7,30.35 UART.2 | 11.1,29.08 11.73,29.08 12.37,28.45 13.64,28.45 14.28,29.08 14.28,30.25 R3.2 | X0.10 11.1,29.08
N$8
  Top 0.254: X0.8 11.73,32.26 R4.2
  Bottom 0.254: R4.2 11.73,32.26 X0.8 10.78,32.89 9.51,34.16 6.97,34.16 5.7,32.89 UART.1
N$9  (via drill 0.4)
  Top 0.254: X0.13 6.66,27.18 6.66,41.47 8.56,43.37 14.59,43.37 16.5,45.28 v16.5,46.86
  Bottom 0.254: IC2.4 v16.5,46.86
N$10
  Top 0.254: 28.37,28.58 IC1.7 28.34,27.72 28.88,27.18 30.15,27.18 33.07,24.26 33.07,21.08 Y1.1
  Bottom 0.254: Y1.1 34.09,20.07 36.12,20.07 C5.1
N$11
  Top 0.254: 23.48,37.24 IC1.24 20.33,37.19 19.35,38.17 R35.2 17.72,40.3 16.87,41.15 R5.1
N$12
  Bottom 0.508: X9.2 37.45,57.55 D5.A
N$13
  Top 0.254: 30.15,22.48 27.23,22.48 25.07,24.64 24.44,24.64 22.53,26.54 22.53,29.08 23.17,29.72 23.17,32.13 22.8,32.49 IC1.29 | 30.15,22.48 30.4,22.48 31.1,21.78 31.1,16.07 32.06,15.11 36.82,15.11 JP1.5 | R8.2 30.15,22.48
N$14  (via drill 0.4)
  Top 0.254: OK1.3 v115.56,54.48
  Bottom 0.254: R15.2 115.45,54.59 v115.56,54.48
N$15
  Top 0.254: IC1.20 26.74,39.33 26.97,39.56 C1.1
N$16  (via drill 0.41)
  Top 0.254: IC1.18 28.34,38.07 29.01,38.73 v31.04,38.73
  Top 0.508: C2.1 32.06,39.24 31.55,38.73 v31.04,38.73
  Bottom 0.254: v31.04,38.73 31.04,35.69 30.53,35.18 30.53,34.16 FB1.2
N$17
  Top 0.254: IC6.6 | 18.72,23.37 C8.1
  Top 0.508: IC6.6 21.26,23.37 18.72,23.37
N$18
  Top 0.254: 30.53,34.8 IC1.15 29.86,34.89 29.51,34.54 29.51,29.72 30.15,29.08 30.78,29.08 33.01,26.86 34.6,26.86 39.36,22.1 39.36,17.02 38.72,16.38 38.72,14.48 JP1.4
N$19  (via drill 0.4)
  Top 0.254: IC1.17 29.14,38.04 29.32,38.23 30.34,38.23 30.85,37.72 32.63,37.72 v33.01,37.34 | v33.64,28.13 34.28,28.13 39.99,22.42 JP1.3
  Bottom 0.254: v33.64,28.13 32.69,29.08 32.69,37.02 v33.01,37.34
N$20  (via drill 0.4)
  Top 0.254: IC1.16 30.66,35.69 34.85,35.69 v35.23,36.07 | v35.86,29.08 35.86,27.5 42.53,20.83 JP1.1
  Bottom 0.254: v35.23,36.07 34.6,35.43 34.6,32.89 35.86,31.62 v35.86,29.08
N$21
  Top 0.508: X10.2 16.98,59.08 R9.1 16.8,54.34 TVS1.C
  Bottom 0.508: IC2.6 17.77,58.29 X10.2
N$22
  Top 0.254: IC6.4 23.17,22.73 23.17,24.32 22.31,25.17 R10.2 R11.2
N$23
  Top 0.508: X10.3 19.82,59.08 R9.2 20,54.34 TVS2.C
  Bottom 0.508: IC2.7 19.04,58.29 X10.3
N$24
  Top 0.508: C15.2 27.29,58.93 X10.4
  Bottom 0.508: X10.4 FS1.1
N$25  (via drill 0.41)
  Top 0.254: v30.78,40.13 30.62,40.3 R13.1 27.54,38.32 IC1.19
  Bottom 0.254: v30.78,40.13 31.93,38.99 31.93,22.92 31.74,22.73 R12.2
N$26
  Bottom 0.254: R15.1 111.78,56.29 TVS3.C
  Bottom 0.508: X4.1 TVS3.C
N$27
  Top 0.254: IC6.5 22.28,22.61 22.28,22.23 23.17,21.34 23.8,21.34 24.69,22.23 25.7,22.23 R14.1 25.7,23.24 24.94,24 24.44,24 22.02,26.42 22.02,29.97 IC1.32
N$28
  Bottom 0.254: R16.1 116.86,56.29 TVS4.C
  Bottom 0.508: X4.2 TVS4.C
N$29  (via drill 0.4)
  Top 0.254: IC1.1 23.54,27.12 v23.8,26.54 | X0.12 11.73,27.18 20.31,27.18 v20.94,26.54
  Bottom 0.254: v23.8,26.54 v20.94,26.54
N$30
  Bottom 0.508: R17.1 X4.3
N$31
  Top 0.254: X9.1 30.78,58.61 30.78,50.67 26.34,46.23 25.07,46.23 24.44,45.59 24.44,43.37 25.06,42.75 R30.1
  Bottom 0.508: X9.1 D10.A
N$32
  Bottom 0.254: R18.1 102.26,10.8 TVS5.C X7.1
N$33
  Bottom 0.254: X7.2 TVS6.C 97.18,10.8 R19.1
N$34
  Bottom 0.254: X7.3 R20.1
N$35  (via drill 0.4)
  Top 0.254: OK2.3 v100.95,12.57
  Bottom 0.254: R18.2 101.05,12.47 v100.95,12.57
N$36
  Bottom 0.254: R21.1 60.35,56.29 TVS7.C
  Bottom 0.508: X1.1 TVS7.C
N$37  (via drill 0.4)
  Top 0.254: R23.2 v32.37,45.91 | IC1.10 33.23,30.89 v33.64,31.31
  Bottom 0.254: v32.37,45.91 32.37,39.56 33.96,37.97 33.96,37.02 33.33,36.39 33.33,31.62 v33.64,31.31
N$38  (via drill 0.4)
  Top 0.254: R22.2 v34.28,45.91 | IC1.9 34.65,30.09 v34.91,30.35
  Bottom 0.254: v34.28,45.91 34.28,38.61 34.6,38.29 34.6,36.7 33.96,36.07 33.96,32.26 34.91,31.31 v34.91,30.35
N$39  (via drill 0.4)
  Top 0.254: OK3.3 v64.12,54.48
  Bottom 0.254: R21.2 64.02,54.59 v64.12,54.48
N$40
  Bottom 0.254: R24.1 65.43,56.29 TVS8.C
  Bottom 0.508: X1.2 TVS8.C
N$41
  Bottom 0.508: X1.3 R25.1
N$42
  Bottom 0.254: R26.1 67.97,10.8 TVS9.C X5.1
N$43
  Bottom 0.254: X5.2 TVS10.C 62.89,10.8 R27.1
N$44
  Bottom 0.254: X5.3 R31.1
N$45
  Bottom 0.254: X8.1 TVS11.C 119.4,10.8 R32.1
N$46
  Bottom 0.254: X8.2 TVS12.C 114.32,10.8 R36.1
N$47
  Bottom 0.254: X8.3 R37.1
N$48
  Bottom 0.254: R38.1 97.14,56.39 97,56.25 TVS13.C
  Bottom 0.508: X3.1 TVS13.C
N$49
  Bottom 0.254: R39.1 102.19,56.25 TVS14.C
  Bottom 0.508: X3.2 TVS14.C
N$50
  Bottom 0.508: X3.3 R42.1
N$51
  Bottom 0.254: R43.1 77.49,56.29 TVS15.C
  Bottom 0.508: X2.1 TVS15.C
N$52
  Bottom 0.254: R44.1 82.57,56.29 TVS16.C
  Bottom 0.508: X2.2 TVS16.C
N$53
  Bottom 0.508: X2.3 R45.1
N$54
  Bottom 0.254: X6.1 TVS17.C 85.11,10.8 R46.1
N$55
  Bottom 0.254: X6.2 TVS18.C 80.03,10.8 R47.1
N$56
  Bottom 0.254: X6.3 R48.1
N$57  (via drill 0.4)
  Top 0.254: OK4.3 v66.66,12.57
  Bottom 0.254: R26.2 66.77,12.47 v66.66,12.57
N$58  (via drill 0.4)
  Top 0.254: OK5.3 v118.1,12.57
  Bottom 0.254: R32.2 118.2,12.47 v118.1,12.57
N$59  (via drill 0.4)
  Top 0.254: OK6.3 v98.41,54.48
  Bottom 0.254: R38.2 97.25,54.48 v98.41,54.48
N$60  (via drill 0.4)
  Top 0.254: OK7.3 v81.27,54.48
  Bottom 0.254: R43.2 81.16,54.59 v81.27,54.48
N$61
  Top 0.254: IC1.22 25.14,40.22 R30.2 R29.2
N$62  (via drill 0.4)
  Top 0.254: OK8.3 v83.81,12.57
  Bottom 0.254: R46.2 83.91,12.47 v83.81,12.57
N$63  (via drill 0.4)
  Top 0.508: v124.45,55.75 123.81,55.75 | 123.81,55.75 v107.3,55.75 v90.16,55.75 v73.01,55.75 57.77,55.75 v56.5,57.02 53.01,60.52 IC3.4 | 123.81,55.75 123.81,11.3 v109.21,11.3 v92.06,11.3 v74.92,11.3 62.85,11.3 v60.31,13.84
  Bottom 0.254: R42.2 106.14,54.59 v107.3,55.75 | R17.2 123.28,54.59 v124.45,55.75 | R45.2 88.99,54.59 v90.16,55.75 | R65.1 56.92,56.29 56.5,56.71 v56.5,57.02 | R48.2 76.08,12.47 v74.92,11.3 | R20.2 93.23,12.47 v92.06,11.3 | R37.2 110.38,12.47 v109.21,11.3 | R25.2 71.85,54.59 v73.01,55.75 | R31.2 v60.31,13.84
  Bottom 0.508: C16.1 51.55,60.65 IC3.4
N$64  (via drill 0.41)
  Top 0.254: IC1.23 24.31,37.21 24.31,37.97 23.55,38.73 v23.04,38.73
  Bottom 0.254: R34.1 16.05,39.24 | R33.1 R34.1 | R34.1 22.53,39.24 v23.04,38.73
N$65  (via drill 0.4)
  Top 0.254: OK1.1 119.23,53.08 v119.37,53.21
  Bottom 0.254: R16.2 v119.37,53.21
N$66  (via drill 0.4)
  Top 0.254: OK2.1 97.28,13.98 v97.14,13.84
  Bottom 0.254: R19.2 v97.14,13.84
N$67  (via drill 0.4)
  Top 0.254: OK3.1 67.8,53.08 v67.93,53.21
  Bottom 0.254: R24.2 v67.93,53.21
N$68  (via drill 0.4)
  Top 0.254: IC1.26 20.62,34.89 v20.39,35.12 | R40.2 21.19,38.92 v20.64,38.37
  Bottom 0.254: R41.1 20.89,32.51 20.39,33.01 v20.39,35.12 20.39,38.12 v20.64,38.37
N$69  (via drill 0.4)
  Top 0.254: OK4.1 62.99,13.98 v62.85,13.84
  Bottom 0.254: R27.2 v62.85,13.84
N$70  (via drill 0.4)
  Top 0.254: OK5.1 114.42,13.98 v114.29,13.84
  Bottom 0.254: R36.2 v114.29,13.84
N$71  (via drill 0.4)
  Top 0.254: OK6.1 102.09,53.08 v102.22,53.21
  Bottom 0.254: R39.2 v102.22,53.21
N$72  (via drill 0.4)
  Top 0.254: OK7.1 84.94,53.08 v85.08,53.21
  Bottom 0.254: R44.2 v85.08,53.21
N$73  (via drill 0.4)
  Top 0.254: OK8.1 80.13,13.98 v80,13.84
  Bottom 0.254: R47.2 v80,13.84
N$74  (via drill 0.4)
  Top 0.254: OK6.2 v99.68,51.62 97.46,51.62 97.14,51.94 OK6.4 | OK1.2 v116.83,51.62 114.61,51.62 114.29,51.94 OK1.4 | OK7.2 v82.54,51.62 80.31,51.62 80,51.94 OK7.4 | OK3.2 v65.39,51.62 63.17,51.62 62.85,51.94 OK3.4 | OK9.2 v59.04,51.62 | OK4.2 v65.39,15.43 67.61,15.43 67.93,15.11 OK4.4 | OK2.2 v99.68,15.43 101.91,15.43 102.22,15.11 OK2.4 | OK8.2 v82.54,15.43 84.76,15.43 85.08,15.11 OK8.4 | OK5.2 v116.83,15.43 | OK5.4 119.37,15.43
  Top 0.508: v116.83,15.43 119.37,15.43 122.54,15.43 122.54,51.62 v116.83,51.62
  Bottom 0.254: TVS14.A v99.68,51.62 | TVS4.A v116.83,51.62 | TVS3.A 111.75,51.62 | 60.31,51.62 TVS7.A | TVS15.A 77.46,51.62 | TVS16.A v82.54,51.62 | TVS13.A 94.6,51.62 | TVS8.A v65.39,51.62 | TVS10.A v65.39,15.43 | TVS9.A 70.47,15.43 | TVS11.A 121.91,15.43 | TVS12.A v116.83,15.43 | TVS5.A 104.76,15.43 | TVS17.A 87.62,15.43 | TVS18.A v82.54,15.43 | TVS6.A v99.68,15.43
  Bottom 0.508: v116.83,51.62 111.75,51.62 v99.68,51.62 94.6,51.62 v82.54,51.62 77.46,51.62 v65.39,51.62 60.31,51.62 v59.04,51.62 57.45,51.62 55.87,53.21 55.87,56.26 C16.2 54.15,57.97 IC3.3 | v65.39,15.43 70.47,15.43 v82.54,15.43 87.62,15.43 v99.68,15.43 104.76,15.43 v116.83,15.43 121.91,15.43
N$75
  Top 0.254: R22.1 D2.-
N$76  (via drill 0.4)
  Top 0.254: 4.2 v19.67,47.81 v19.67,47.82
  Bottom 0.254: IC2.2 19.04,48.45 v19.67,47.82
N$77  (via drill 0.4)
  Top 0.254: v20.94,27.81 19.67,29.08 13.32,29.08 v13.01,29.4 | IC1.2 24.34,27.59 v24.75,27.18
  Bottom 0.254: X0.7 9.83,31.62 12.37,31.62 12.69,31.31 12.69,29.72 v13.01,29.4 | v24.75,27.18 24.44,27.5 21.26,27.5 v20.94,27.81
N$92  (via drill 0.4)
  Top 0.254: X0.26 44.75,10.03 48.56,13.84 48.56,30.67 46.98,32.26 46.66,32.26 44.12,34.8 v44.12,36.07
  Bottom 0.254: IC5.19 43.17,36.7 43.8,36.07 v44.12,36.07
N$93  (via drill 0.4)
  Top 0.254: OK9.1 60.31,54.16 59.68,54.8 v59.04,54.8
  Bottom 0.254: R65.2 58.83,54.59 v59.04,54.8
N$94  (via drill 0.4)
  Top 0.254: OK9.7 R66.1 57.99,45.17 56.82,44.01 56.82,37.34 v57.14,37.02 | IC1.13 35.63,33.29 v35.86,33.53
  Bottom 0.254: v35.86,33.53 35.86,32.89 36.82,31.94 47.93,31.94 52.38,36.39 56.5,36.39 v57.14,37.02
N$95
  Bottom 0.254: Q1.1 R67.1
N$96  (via drill 0.4)
  Top 0.254: IC1.14 34.84,34.09 36.18,35.43 v36.18,39.24
  Bottom 0.254: R68.2 R67.2 38.19,41.25 v36.18,39.24
N$98
  Bottom 0.508: IC3.1 51.29,52.77 C18.1 48.25,51.48 Q1.3
N$99
  Bottom 0.508: FB2.1 48.23,55.59 C18.2 51.29,55.57 IC3.2
N$115  (via drill 0.4)
  Top 0.254: IC1.12 37.05,32.49 v37.45,32.89 | R69.2 58.09,40.61 58.09,36.7 57.45,36.07 47.3,36.07 v43.8,39.56
  Bottom 0.254: v37.45,32.89 40.63,32.89 42.21,34.48 42.21,36.39 41.9,36.7 IC5.18 41.9,38.93 42.53,39.56 v43.8,39.56
N$116  (via drill 0.4)
  Top 0.254: A0.2
  Bottom 0.254: IC5.15 38.09,36.7 A0.2
  other vias: 37.45,36.07
N$117  (via drill 0.4)
  Top 0.254: v39.36,36.07
  Bottom 0.254: IC5.16 v39.36,36.07
N$118  (via drill 0.4)
  Top 0.254: A2.2
  Bottom 0.254: IC5.17 40.63,36.7 A2.2
  other vias: 41.26,36.07
N$119
  Top 0.254: R23.1 D1.-
SCL  (via drill 0.4)
  Top 0.254: v13.26,34.16 18.72,34.16 19.59,33.29 IC1.28 24.2,33.29 v25.07,34.16 | IC7.5 v40.94,26.23 v40.95,26.23 41.9,25.27 44.44,25.27 46.34,27.18 v46.34,30.67 42.53,34.48 42.53,38.61 41.9,39.24 41.26,39.24 36.5,44.01 v25.39,44.01
  Bottom 0.254: R6.1 v13.26,34.16 10.46,34.16 9.2,35.43 X0.5 | IC5.12 40.63,26.54 v40.95,26.23 | v25.07,34.16 25.39,34.48 v25.39,44.01
  Bottom 0.508: v46.34,30.67 128.58,30.67 I2C.2
SDA  (via drill 0.4)
  Top 0.254: v13.2,35.31 13.96,34.8 19.04,34.8 19.74,34.09 IC1.27 23.41,34.09 v23.8,34.48 | IC7.4 v39.04,26.23 | v25.39,45.28 26.02,44.64 36.82,44.64 41.58,39.88 42.21,39.88 43.17,38.93 43.17,34.8 46.34,31.62 46.66,31.62 47.61,30.67 v47.61,29.72
  Bottom 0.254: 8.5,37.97 X0.3 9.83,36.7 11.54,36.7 12.18,36.07 13.07,36.07 | R7.1 13.07,36.07 | v13.2,35.31 13.2,35.94 13.07,36.07 | v39.04,26.23 39.36,26.54 IC5.13 39.36,29.4 39.67,29.72 42.21,29.72 43.49,30.99 44.75,30.99 46.03,29.72 v47.61,29.72 | v23.8,34.48 24.75,35.43 24.75,43.05 24.44,43.37 24.44,44.32 v25.39,45.28
  Bottom 0.508: v47.61,29.72 126.99,29.72 I2C.1
VCC  (via drill 0.4, 0.41)
  Top 0.254: A0.1 A1.1 A2.1 40.94,33.95 40.94,32.58 C19.1 | R69.1 60.31,45.81 OK9.8 60.31,49.09 55.23,49.09 53.64,50.67 v43.8,50.67 | 118.1,49.09 OK1.8 | OK1.6 115.56,49.09 | OK6.8 100.95,49.09 | OK6.6 98.41,49.09 | OK7.8 83.81,49.09 | OK7.6 81.27,49.09 | OK3.8 66.66,49.09 | OK3.6 64.12,49.09 | OK5.6 118.1,17.97 | 64.12,17.97 OK4.8 | OK4.6 66.66,17.97 | OK8.8 81.27,17.97 | OK8.6 83.81,17.97 | OK2.8 98.41,17.97 | OK2.6 100.95,17.97 | OK5.8 115.56,17.97 | D1.+ D2.+ 38.6,53.34 v41.26,50.67
  Top 0.508: C3.1 27.61,25.53 v26.34,25.53 25.94,25.93 IC1.4 | IC1.6 27.54,25.56 C3.1 | 40.94,32.58 IC7.1 44.08,30.07 v44.12,30.04 | 60.31,49.09 64.12,49.09 66.66,49.09 67.93,49.09 | 67.93,49.09 81.27,49.09 83.81,49.09 98.41,49.09 100.95,49.09 115.56,49.09 118.1,49.09 | 118.1,17.97 115.56,17.97 100.95,17.97 98.41,17.97 83.81,17.97 81.27,17.97 66.66,17.97 64.12,17.97 63.49,17.97 61.58,19.88 v61.58,21.46 61.58,36.7 67.93,43.05 67.93,49.09 | C3.1 27.71,25.59 v28.88,25.59 30.05,25.59 R8.1 30.57,25.49 32.06,24 32.06,16.89 v32.82,16.13
  Bottom 0.254: 30.4,32.26 30.4,27.11 v28.88,25.59 | R41.2 25.26,32.51 25.89,31.88 25.89,29.47 C23.+ | v41.26,50.67 v43.8,50.67
  Bottom 0.508: IC4.1 18.21,24.26 22.25,24.26 C17.2 22.31,25.06 22.85,25.59 26.28,25.59 v26.34,25.53 25.96,25.91 C23.+ | 30.4,32.26 FB1.1 | v44.12,30.04 44.44,29.72 IC5.9 44.44,21.46 | 44.44,21.46 v61.58,21.46 | 44.44,21.46 44.44,18.29 | 44.44,18.29 44.44,15.11 JP1.2 | v32.82,16.13 34.98,18.29 44.44,18.29
X1.1  (via drill 0.4)
  Top 0.254: OK3.5 v62.85,46.23 R53.1
  Bottom 0.254: IC5.21 45.71,38.29 50.15,42.73 62.53,42.73 62.85,43.05 v62.85,46.23
X1.2  (via drill 0.4)
  Top 0.254: OK3.7 v65.39,46.23 R54.1
  Bottom 0.254: IC5.22 46.98,38.29 50.79,42.1 65.07,42.1 65.39,42.42 v65.39,46.23
X2.1  (via drill 0.4)
  Top 0.254: OK7.5 v80,46.23 R61.1
  Bottom 0.254: IC5.23 48.25,38.29 51.42,41.47 79.36,41.47 80,42.1 v80,46.23
X2.2  (via drill 0.4)
  Top 0.254: OK7.7 v82.54,46.23 R62.1
  Bottom 0.254: IC5.24 49.52,38.29 52.06,40.83 81.9,40.83 82.54,41.47 v82.54,46.23
X3.1  (via drill 0.4)
  Top 0.254: OK6.5 v97.14,46.23 R59.1
  Bottom 0.254: IC5.25 50.79,38.29 52.69,40.2 95.87,40.2 97.14,41.47 v97.14,46.23
X3.2  (via drill 0.4)
  Top 0.254: OK6.7 v99.68,46.23 R60.1
  Bottom 0.254: IC5.26 52.06,38.29 53.33,39.56 97.78,39.56 99.68,41.47 v99.68,46.23
X4.1  (via drill 0.4)
  Top 0.254: OK1.5 v114.29,46.23 R49.1
  Bottom 0.254: IC5.27 53.33,38.29 53.96,38.93 111.75,38.93 114.29,41.47 v114.29,46.23
X4.2  (via drill 0.4)
  Top 0.254: OK1.7 v116.83,46.23 R50.1
  Bottom 0.254: v116.83,46.23 116.83,41.78 113.33,38.29 55.23,38.29 IC5.28
X5.1  (via drill 0.4)
  Top 0.254: R55.1 v67.93,20.83 OK4.5
  Bottom 0.254: IC5.7 46.98,27.5 50.79,23.69 66.35,23.69 67.93,22.1 v67.93,20.83
X5.2  (via drill 0.4)
  Top 0.254: R56.1 v65.39,20.83 OK4.7
  Bottom 0.254: IC5.8 45.71,27.5 50.15,23.05 64.44,23.05 65.39,22.1 v65.39,20.83
X6.1  (via drill 0.4)
  Top 0.254: R63.1 v85.08,20.83 OK8.5
  Bottom 0.254: IC5.5 49.52,27.5 52.06,24.96 83.81,24.96 85.08,23.69 v85.08,20.83
X6.2  (via drill 0.4)
  Top 0.254: R64.1 v82.54,20.83 OK8.7
  Bottom 0.254: IC5.6 48.25,27.5 51.42,24.32 81.9,24.32 82.54,23.69 v82.54,20.83
X7.1  (via drill 0.4)
  Top 0.254: R51.1 v102.22,20.83 OK2.5
  Bottom 0.254: IC5.3 52.06,27.5 53.33,26.23 100.32,26.23 102.22,24.32 v102.22,20.83
X7.2  (via drill 0.4)
  Top 0.254: R52.1 v99.68,20.83 OK2.7
  Bottom 0.254: IC5.4 50.79,27.5 52.69,25.59 98.41,25.59 99.68,24.32 v99.68,20.83
X8.1  (via drill 0.4)
  Top 0.254: OK5.5 v119.37,20.83 R57.1
  Bottom 0.254: IC5.1 54.6,28.13 55.23,27.5 116.19,27.5 119.37,24.32 v119.37,20.83
X8.2  (via drill 0.4)
  Top 0.254: OK5.7 v116.83,20.83 R58.1
  Bottom 0.254: IC5.2 53.33,27.5 53.96,26.86 114.29,26.86 116.83,24.32 v116.83,20.83
Z3V3
  Bottom 0.508: 16.05,29.08 16.05,31.62 R4.1 16.05,31.75 16.05,34.16 R6.2 16.05,34.29 16.05,36.7 R7.2 16.05,36.83 14.4,38.48 14.4,39.24 R34.2 | 16.05,29.08 R3.1 | X0.17 8.56,20.83 9.83,22.1 9.83,23.37 10.46,24 11.99,24 12.62,24.64 15.23,24.64 16.08,25.49 16.05,25.51 16.05,29.08 | X0.1 9.2,40.51 10.46,39.24 R34.2 | IC2.8 20.41,56.39 20.94,56.39 21.58,55.75 21.58,54.16 20.63,53.21 16.5,53.21 15.54,52.26 C7.2 13.96,50.67 14.28,50.35 C6.2 14.28,39.34 R34.2
Z5V
  Top 0.508: X0.2 X0.4 | 14.28,37.97 14.28,41.15 R5.2 | 14.28,37.97 C14.+ 14.15,37.85 | X0.4 9.83,36.7 9.83,22.1 10.46,21.46 12.56,21.46 12.87,21.15 C9.2 R11.1 | 14.28,37.97 X0.4
  Top 1.016: C9.2 14.28,16.7 | C22.2 14.28,16.7 | 14.28,16.7 L4.7.P$2

### Text on the board
Top: TOP
Bottom: BOTTOM
tNames: H1.0 | 0 / / 1 | RX | GND | TX | SCL | GR | SDA
bNames: 12V B A GND | - PS A | 0 2 1 | 0 2 1 | 0 2 1 | 0 2 1 | 1 2 0 | 1 2 0 | 1 2 0 | 1 2 0